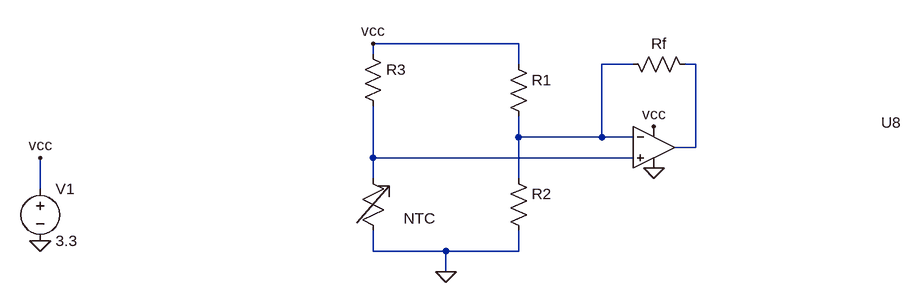
[diagram p0: schematic NTCAFE.asc]
NTCAFE.asc, the LTspice schematic file:
Version 4
SHEET 1 4004 680
WIRE 720 -80 496 -80
WIRE 496 -64 496 -80
WIRE 720 -48 720 -80
WIRE 896 -48 848 -48
WIRE 992 -48 976 -48
WIRE 720 64 720 32
WIRE 848 64 848 -48
WIRE 848 64 720 64
WIRE 896 64 848 64
WIRE 992 80 992 -48
WIRE 992 80 960 80
WIRE 496 96 496 16
WIRE 896 96 496 96
WIRE 496 128 496 96
WIRE 720 128 720 64
WIRE -16 144 -16 96
WIRE 496 240 496 208
WIRE 608 240 496 240
WIRE 720 240 720 208
WIRE 720 240 608 240
WIRE 608 272 608 240
FLAG -16 224 0
FLAG -16 96 vcc
FLAG 928 48 vcc
FLAG 928 112 0
FLAG 608 272 0
FLAG 496 -80 vcc
SYMBOL Voltage -16 128 R0
SYMATTR InstName V1
SYMATTR Value 3.3
SYMBOL UniversalOpAmp 928 80 R0
WINDOW 0 350 -38 Left 2
SYMATTR InstName U8
SYMBOL res 992 -32 M270
WINDOW 0 32 56 VTop 2
WINDOW 3 0 56 VBottom 2
SYMATTR InstName Rf
SYMATTR Value ""
SYMBOL res 704 -64 R0
SYMATTR InstName R1
SYMATTR Value ""
SYMBOL res 704 112 R0
SYMATTR InstName R2
SYMATTR Value ""
SYMBOL VarRes 480 112 R0
SYMATTR InstName NTC
SYMATTR Value ""
SYMBOL res 480 -80 R0
SYMATTR InstName R3
SYMATTR Value ""

The netlist it stands for:
* NTCAFE.asc
V1 vcc 0 3.3
XU8 N003 N001 vcc 0 N002 level1 Avol=1Meg GBW=10Meg Vos=0 En=0 Enk=0 In=0 Ink=0 Rin=500Meg  ; pins In+ In- V+ V- OUT
Rf N002 N001
R1 vcc N001
R2 N001 0
R§NTC N003 0
R3 vcc N003
.lib UniversalOpAmp1.lib
.backanno
.end